# Altium project Radios_Comunitarias.PrjPcb
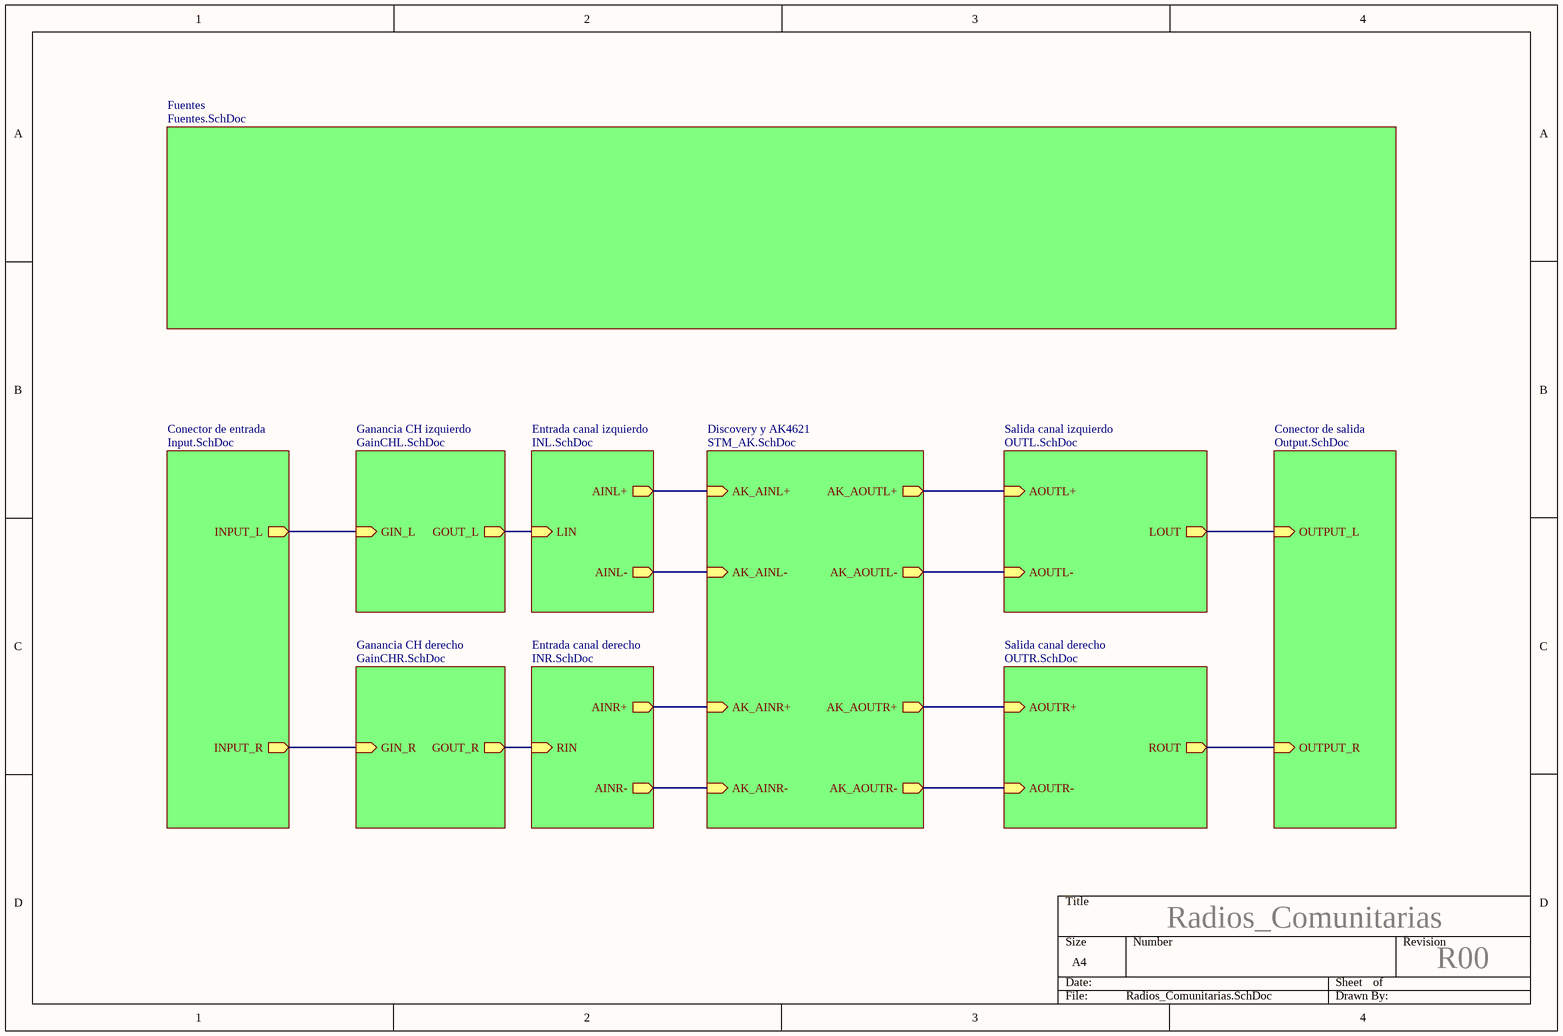
[diagram p0: Radios_Comunitarias.SchDoc]
11 sheets, 217 parts. Net scope: hierarchical (ports join the sheet entries above them; power ports are global).
Board file: Radios_Comunitarias.PcbDoc
Sheets:
  Radios_Comunitarias.SchDoc
    Entrada canal izquierdo = INL.SchDoc
    Entrada canal derecho = INR.SchDoc
    Discovery y AK4621 = STM_AK.SchDoc
    Salida canal izquierdo = OUTL.SchDoc
    Salida canal derecho = OUTR.SchDoc
    Conector de entrada = Input.SchDoc
    Conector de salida = Output.SchDoc
    Fuentes = Fuentes.SchDoc
    Ganancia CH izquierdo = GainCHL.SchDoc
    Ganancia CH derecho = GainCHR.SchDoc

## Sheet Radios_Comunitarias.SchDoc
size A4

### Sub-sheets
Conector de entrada = Input.SchDoc: INPUT_L (out), INPUT_R (out)
Conector de salida = Output.SchDoc: OUTPUT_R (in), OUTPUT_L (in)
Discovery y AK4621 = STM_AK.SchDoc: AK_AINL+ (in), AK_AINL- (in), AK_AINR- (in), AK_AINR+ (in), AK_AOUTL+ (out), AK_AOUTL- (out), AK_AOUTR+ (out), AK_AOUTR- (out)
Entrada canal derecho = INR.SchDoc: RIN (in), AINR+ (out), AINR- (out)
Entrada canal izquierdo = INL.SchDoc: LIN (in), AINL+ (out), AINL- (out)
Fuentes = Fuentes.SchDoc: no entries
Ganancia CH derecho = GainCHR.SchDoc: GOUT_R (out), GIN_R (in)
Ganancia CH izquierdo = GainCHL.SchDoc: GIN_L (in), GOUT_L (out)
Salida canal derecho = OUTR.SchDoc: AOUTR- (in), AOUTR+ (in), ROUT (out)
Salida canal izquierdo = OUTL.SchDoc: AOUTL+ (in), AOUTL- (in), LOUT (out)

### Nets
AINL_N: sheet Entrada canal izquierdo/AINL-, sheet Discovery y AK4621/AK_AINL-
AINL_P: sheet Entrada canal izquierdo/AINL+, sheet Discovery y AK4621/AK_AINL+
AINR_N: sheet Entrada canal derecho/AINR-, sheet Discovery y AK4621/AK_AINR-
AINR_P: sheet Entrada canal derecho/AINR+, sheet Discovery y AK4621/AK_AINR+
NetC25_2: sheet Entrada canal izquierdo/LIN, sheet Ganancia CH izquierdo/GOUT_L
NetC36_2: sheet Entrada canal derecho/RIN, sheet Ganancia CH derecho/GOUT_R
NetCN2_2: sheet Conector de entrada/INPUT_L, sheet Ganancia CH izquierdo/GIN_L
NetCN3_2: sheet Conector de entrada/INPUT_R, sheet Ganancia CH derecho/GIN_R
NetJP10_1: sheet Discovery y AK4621/AK_AOUTL-, sheet Salida canal izquierdo/AOUTL-
NetJP11_1: sheet Discovery y AK4621/AK_AOUTL+, sheet Salida canal izquierdo/AOUTL+
NetJP12_1: sheet Discovery y AK4621/AK_AOUTR-, sheet Salida canal derecho/AOUTR-
NetJP13_1: sheet Discovery y AK4621/AK_AOUTR+, sheet Salida canal derecho/AOUTR+
NetP3_1: sheet Salida canal izquierdo/LOUT, sheet Conector de salida/OUTPUT_L
NetP4_1: sheet Salida canal derecho/ROUT, sheet Conector de salida/OUTPUT_R

### Notes on the sheet
- Radios_Comunitarias
- R00

## Sheet INL.SchDoc
size A4
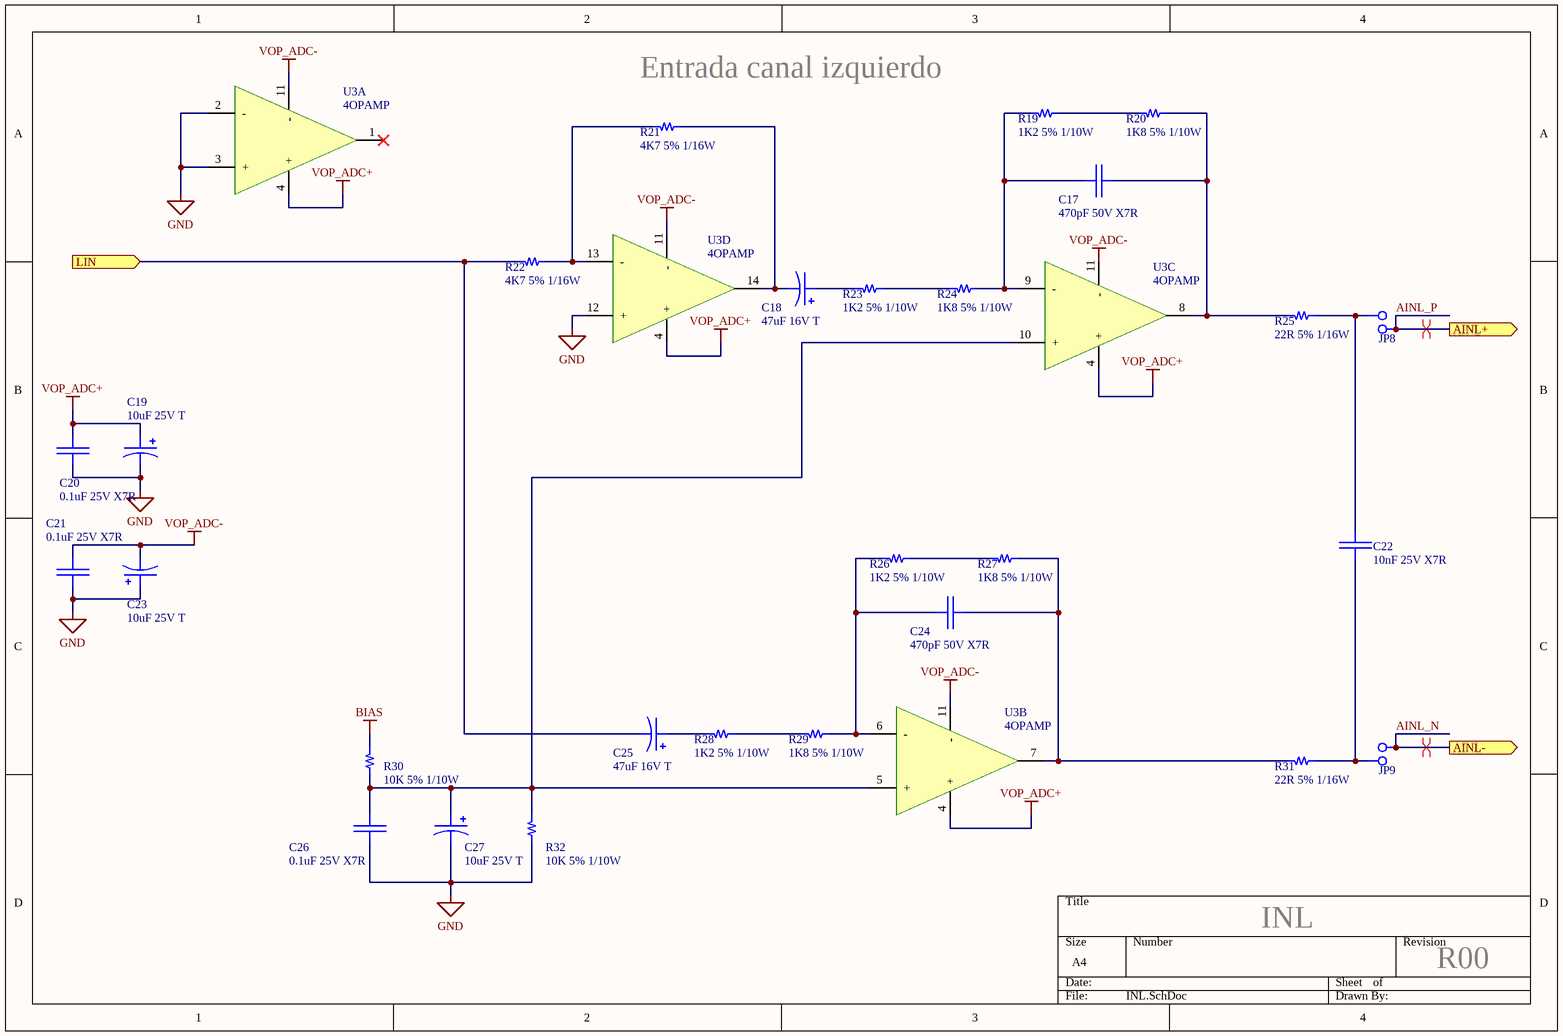
[diagram p1: INL.SchDoc]

### Parts
C17  470pF 50V X7R  [C_0805]
C18  47uF 16V T  [TANT]
C19  10uF 25V T  [TANT]
C20  0.1uF 25V X7R  [C_0805]
C21  0.1uF 25V X7R  [C_0805]
C22  10nF 25V X7R  [C_0805]
C23  10uF 25V T  [TANT]
C24  470pF 50V X7R  [C_0805]
C25  47uF 16V T  [TANT]
C26  0.1uF 25V X7R  [C_0805]
C27  10uF 25V T  [TANT]
JP8  Jumper 2x1  [Conn_2_1]  (value not drawn)
JP9  Jumper 2x1  [Conn_2_1]  (value not drawn)
R19  1K2 5% 1/10W  [R_0805]
R20  1K8 5% 1/10W  [R_0805]
R21  4K7 5% 1/16W  [R_0805]
R22  4K7 5% 1/16W  [R_0805]
R23  1K2 5% 1/10W  [R_0805]
R24  1K8 5% 1/10W  [R_0805]
R25  22R 5% 1/16W  [R_0805]
R26  1K2 5% 1/10W  [R_0805]
R27  1K8 5% 1/10W  [R_0805]
R28  1K2 5% 1/10W  [R_0805]
R29  1K8 5% 1/10W  [R_0805]
R30  10K 5% 1/10W  [R_0805]
R31  22R 5% 1/16W  [R_0805]
R32  10K 5% 1/10W  [R_0805]
U3  4OPAMP  [SOIC14]  (parts A,B,C,D of 4)

### Ports
AINL+ (out), AINL- (out), LIN (in)

### Nets
BIAS: R30.2  [project net AVDD]
GND: C19.2 C20.2 C21.2 C23.1 C26.2 C27.2 R32.1 U3.2(-) U3.3(+) U3.12(+)  [project net GROUND]
VOP_ADC+: C19.1 C20.1 U3.4(+)
VOP_ADC-: C21.1 C23.2 U3.11(-)
AINL_N: JP9.1 ; port AINL-
AINL_P: JP8.2 ; port AINL+
NetC17_1: C17.1 R19.2 R24.1 U3.9(-)
NetC17_2: C17.2 R20.1 R25.2 U3.8(OUT)
NetC18_1: C18.1 R23.2
NetC18_2: C18.2 R21.1 U3.14(OUT)
NetC22_1: C22.1 JP9.2 R31.1
NetC22_2: C22.2 JP8.1 R25.1
NetC24_1: C24.1 R26.2 R29.1 U3.6(-)
NetC24_2: C24.2 R27.1 R31.2 U3.7(OUT)
NetC25_1: C25.1 R28.2
NetC25_2: C25.2 R22.2 ; port LIN
NetC26_1: C26.1 C27.1 R30.1 R32.2 U3.5(+) U3.10(+)
NetR19_1: R19.1 R20.2
NetR21_2: R21.2 R22.1 U3.13(-)
NetR23_1: R23.1 R24.2
NetR26_1: R26.1 R27.2
NetR28_1: R28.1 R29.2

Not connected (* = marked no-connect by the designer): U3 1(OUT)*

### Layout directives
differential pair: AINL_N, AINL_P

### Notes on the sheet
- Entrada canal izquierdo
- INL
- R00

### Library data of the parts
C17 C24 = Capacitor: Capacitor de placas paralelas; Encapsulado: 0805; Cod. Proveedor: -; Proveedor: -
C18 C19 C23 C25 C27 = CapaPol: Capacitor polarizado; Encapsulado: TH; Cod. Proveedor: -; Proveedor: -
C20 C21 = Capacitor: Capacitor de placas paralelas; Cod. Proveedor: CA3289100; Encapsulado: 0603; Proveedor: Elemon
C22 = Capacitor: Capacitor de placas paralelas; Cod. Proveedor: CA3289050; Encapsulado: 0603; Proveedor: Elemon
C26 = Capacitor: Capacitor de placas paralelas
R19 R23 R26 R28 R30 R32 = Resistor: Resistencia; Encapsulado: 0805; Cod. Proveedor: -; Proveedor: -
R20 R24 R27 R29 = Resistor: Resistencia; Cod. Proveedor: RS3896200; Encapsulado: 0805; Proveedor: Elemon
R21 = Resistor: Resistencia; Cod. Proveedor: RS3896225; Proveedor: Elemon; Encapsulado: 0805
R22 = Resistor: Resistencia; Proveedor: Elemon; Cod. Proveedor: RS3896225; Encapsulado: 0805
R25 R31 = Resistor: Resistencia; Encapsulado: 0603; Cod. Proveedor: -; Proveedor: -
U3 = 4OPAMP: Integrado con 4 operacionales

## Sheet INR.SchDoc
size A4
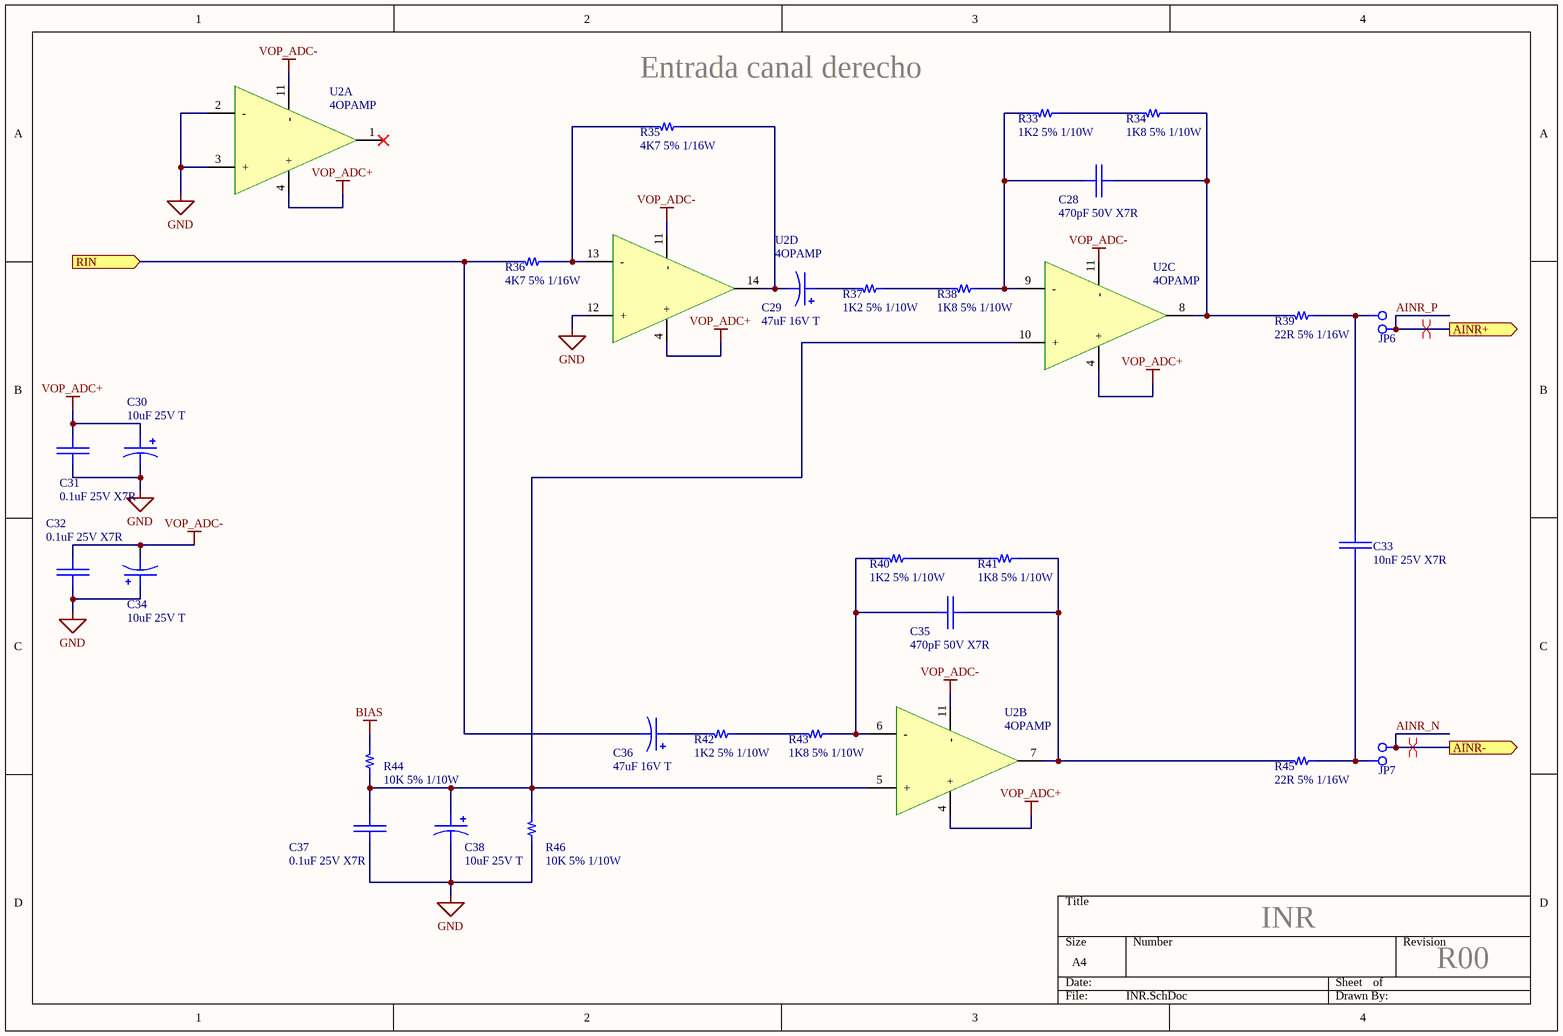
[diagram p2: INR.SchDoc]

### Parts
C28  470pF 50V X7R  [C_0805]
C29  47uF 16V T  [TANT]
C30  10uF 25V T  [TANT]
C31  0.1uF 25V X7R  [C_0805]
C32  0.1uF 25V X7R  [C_0805]
C33  10nF 25V X7R  [C_0805]
C34  10uF 25V T  [TANT]
C35  470pF 50V X7R  [C_0805]
C36  47uF 16V T  [TANT]
C37  0.1uF 25V X7R  [C_0805]
C38  10uF 25V T  [TANT]
JP6  Jumper 2x1  [Conn_2_1]  (value not drawn)
JP7  Jumper 2x1  [Conn_2_1]  (value not drawn)
R33  1K2 5% 1/10W  [R_0805]
R34  1K8 5% 1/10W  [R_0805]
R35  4K7 5% 1/16W  [R_0805]
R36  4K7 5% 1/16W  [R_0805]
R37  1K2 5% 1/10W  [R_0805]
R38  1K8 5% 1/10W  [R_0805]
R39  22R 5% 1/16W  [R_0805]
R40  1K2 5% 1/10W  [R_0805]
R41  1K8 5% 1/10W  [R_0805]
R42  1K2 5% 1/10W  [R_0805]
R43  1K8 5% 1/10W  [R_0805]
R44  10K 5% 1/10W  [R_0805]
R45  22R 5% 1/16W  [R_0805]
R46  10K 5% 1/10W  [R_0805]
U2  4OPAMP  [SOIC14]  (parts A,B,C,D of 4)

### Ports
AINR+ (out), AINR- (out), RIN (in)

### Nets
BIAS: R44.2  [project net AVDD]
GND: C30.2 C31.2 C32.2 C34.1 C37.2 C38.2 R46.1 U2.2(-) U2.3(+) U2.12(+)  [project net GROUND]
VOP_ADC+: C30.1 C31.1 U2.4(+)
VOP_ADC-: C32.1 C34.2 U2.11(-)
AINR_N: JP7.1 ; port AINR-
AINR_P: JP6.2 ; port AINR+
NetC28_1: C28.1 R33.2 R38.1 U2.9(-)
NetC28_2: C28.2 R34.1 R39.2 U2.8(OUT)
NetC29_1: C29.1 R37.2
NetC29_2: C29.2 R35.1 U2.14(OUT)
NetC33_1: C33.1 JP7.2 R45.1
NetC33_2: C33.2 JP6.1 R39.1
NetC35_1: C35.1 R40.2 R43.1 U2.6(-)
NetC35_2: C35.2 R41.1 R45.2 U2.7(OUT)
NetC36_1: C36.1 R42.2
NetC36_2: C36.2 R36.2 ; port RIN
NetC37_1: C37.1 C38.1 R44.1 R46.2 U2.5(+) U2.10(+)
NetR33_1: R33.1 R34.2
NetR35_2: R35.2 R36.1 U2.13(-)
NetR37_1: R37.1 R38.2
NetR40_1: R40.1 R41.2
NetR42_1: R42.1 R43.2

Not connected (* = marked no-connect by the designer): U2 1(OUT)*

### Layout directives
differential pair: AINR_N, AINR_P

### Notes on the sheet
- (near R35) Entrada canal derecho
- INR
- R00

### Library data of the parts
C28 C35 = Capacitor: as C17 on sheet INL; Cod. Proveedor: -; Proveedor: -
C29 C30 C34 C36 C38 = CapaPol: Capacitor polarizado; Encapsulado: TH; Cod. Proveedor: -; Proveedor: -
C31 C32 = Capacitor: as C20 on sheet INL
C33 C37 = Capacitor: Capacitor de placas paralelas
R33 R37 R40 R42 R44 R46 = Resistor: Resistencia; Encapsulado: 0805; Cod. Proveedor: -; Proveedor: -
R34 R38 R41 R43 = Resistor: as R20 on sheet INL
R35 R36 = Resistor: as R21 on sheet INL
R39 R45 = Resistor: Resistencia; Encapsulado: 0603; Cod. Proveedor: -; Proveedor: -
U2 = 4OPAMP: Integrado con 4 operacionales

## Sheet STM_AK.SchDoc
size A4
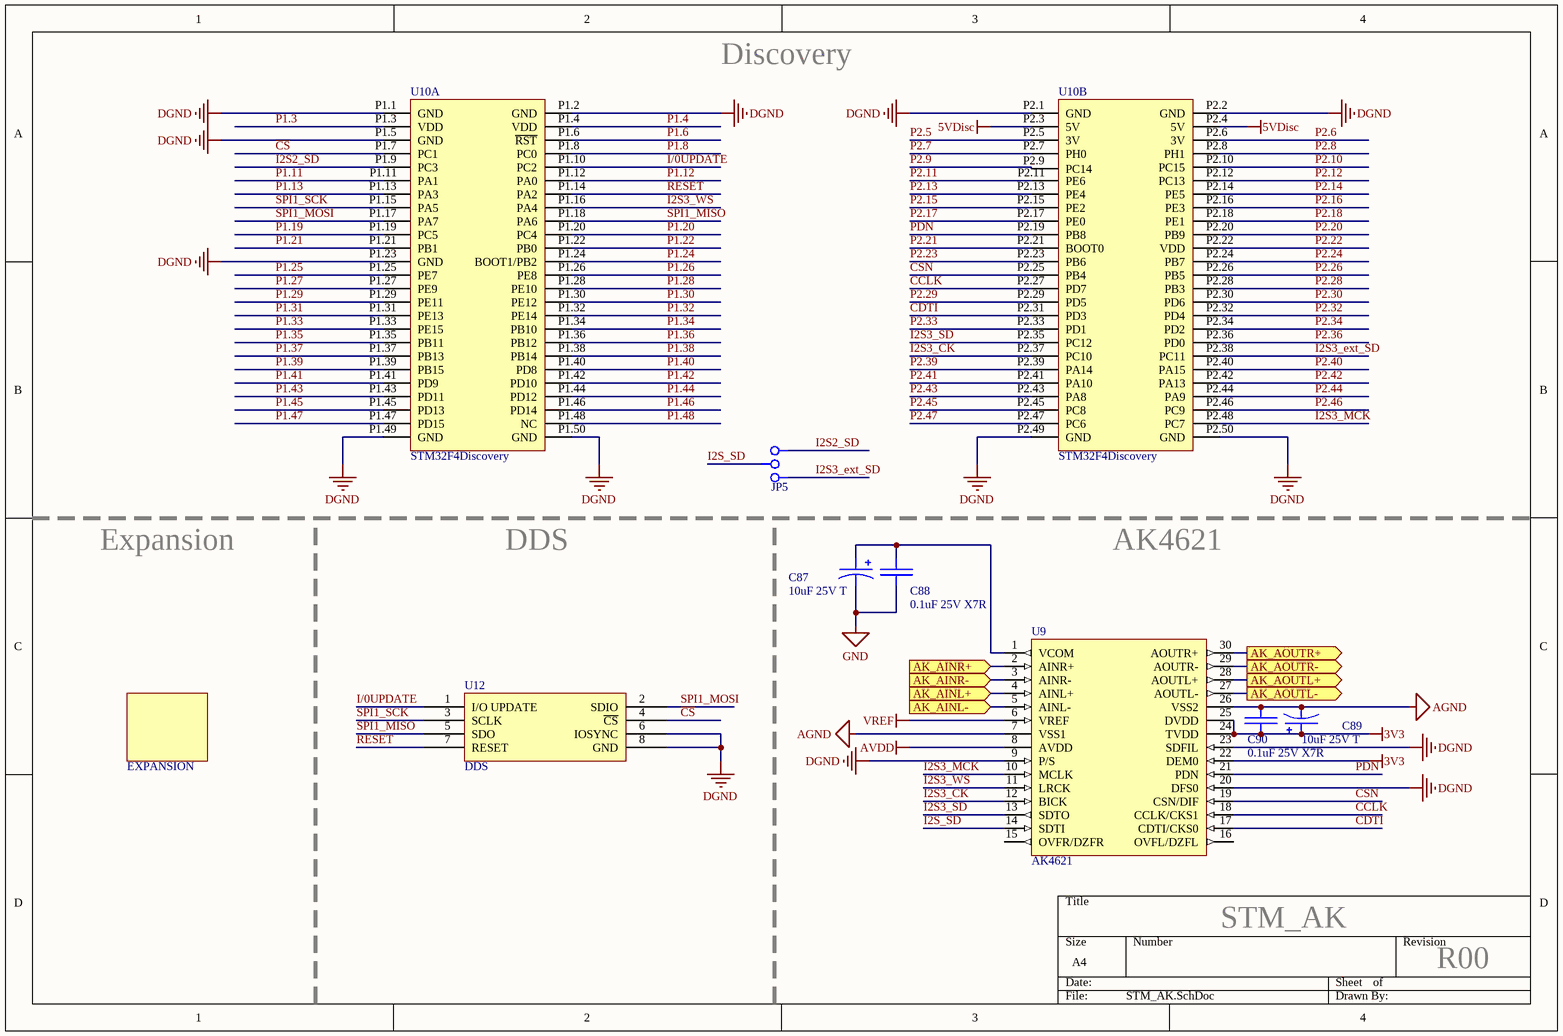
[diagram p3: STM_AK.SchDoc]

### Parts
C87  10uF 25V T  [TANT]
C88  0.1uF 25V X7R  [C_0805]
C89  10uF 25V T  [TANT]
C90  0.1uF 25V X7R  [C_0805]
JP5  Jumper 3x1  [Conn_3_1]  (value not drawn)
U9  AK4621  [AK4621]
U10  STM32F4Discovery  [STM32F4DISCOVERY]  (parts A,B of 2)
U12  DDS  [Conn_2x4]
  EXPANSION  [EXPANSION]

### Ports
AK_AINL+ (in), AK_AINL- (in), AK_AINR+ (in), AK_AINR- (in), AK_AOUTL+ (out), AK_AOUTL- (out), AK_AOUTR+ (out), AK_AOUTR- (out)

### Nets
3V3: C89.1 C90.1 U9.22(DEM0) U9.24(TVDD) U9.25(DVDD)
5VDisc: U10.P2.3(5V) U10.P2.4(5V)
AGND: C89.2 C90.2 U9.7(VSS1) U9.26(VSS2)
AVDD: U9.6(VREF) U9.8(AVDD)  [also labelled VREF]
DGND: U9.9(P/S) U9.20(DFS0) U9.23(SDFIL) U10.P1.1(GND) U10.P1.2(GND) U10.P1.5(GND) U10.P1.23(GND) U10.P1.49(GND) U10.P1.50(GND) U10.P2.1(GND) U10.P2.2(GND) U10.P2.49(GND) U10.P2.50(GND) U12.6(IOSYNC) U12.8(GND)
GND: C87.2 C88.2  [project net GROUND]
AINL_N: U9.5(AINL-) ; port AK_AINL-
AINL_P: U9.4(AINL+) ; port AK_AINL+
AINR_N: U9.3(AINR-) ; port AK_AINR-
AINR_P: U9.2(AINR+) ; port AK_AINR+
~{CS}: U10.P1.7(PC1) U12.4(~{CS})
CCLK: U9.18(CCLK/CKS1) U10.P2.27(PD7)
CDTI: U9.17(CDTI/CKS0) U10.P2.31(PD3)
CSN: U9.19(CSN/DIF) U10.P2.25(PB4)
I2S2_SD: JP5.1 U10.P1.9(PC3)
I2S3_CK: U9.12(BICK) U10.P2.37(PC10)
I2S3_ext_SD: JP5.3 U10.P2.38(PC11)
I2S3_MCK: U9.10(MCLK) U10.P2.48(PC7)
I2S3_SD: U9.13(SDTO) U10.P2.35(PC12)
I2S3_WS: U9.11(LRCK) U10.P1.16(PA4)
I2S_SD: JP5.2 U9.14(SDTI)
I/0UPDATE: U10.P1.10(PC2) U12.1(I/O_UPDATE)
P1.3: U10.P1.3(VDD)
P1.4: U10.P1.4(VDD)
P1.6: U10.P1.6(~{RST})
P1.8: U10.P1.8(PC0)
P1.11: U10.P1.11(PA1)
P1.12: U10.P1.12(PA0)
P1.13: U10.P1.13(PA3)
P1.19: U10.P1.19(PC5)
P1.20: U10.P1.20(PC4)
P1.21: U10.P1.21(PB1)
P1.22: U10.P1.22(PB0)
P1.24: U10.P1.24(BOOT1/PB2)
P1.25: U10.P1.25(PE7)
P1.26: U10.P1.26(PE8)
P1.27: U10.P1.27(PE9)
P1.28: U10.P1.28(PE10)
P1.29: U10.P1.29(PE11)
P1.30: U10.P1.30(PE12)
P1.31: U10.P1.31(PE13)
P1.32: U10.P1.32(PE14)
P1.33: U10.P1.33(PE15)
P1.34: U10.P1.34(PB10)
P1.35: U10.P1.35(PB11)
P1.36: U10.P1.36(PB12)
P1.37: U10.P1.37(PB13)
P1.38: U10.P1.38(PB14)
P1.39: U10.P1.39(PB15)
P1.40: U10.P1.40(PD8)
P1.41: U10.P1.41(PD9)
P1.42: U10.P1.42(PD10)
P1.43: U10.P1.43(PD11)
P1.44: U10.P1.44(PD12)
P1.45: U10.P1.45(PD13)
P1.46: U10.P1.46(PD14)
P1.47: U10.P1.47(PD15)
P1.48: U10.P1.48(NC)
P2.5: U10.P2.5(3V)
P2.6: U10.P2.6(3V)
P2.7: U10.P2.7(PH0)
P2.8: U10.P2.8(PH1)
P2.9: U10.P2.9(PC14)
P2.10: U10.P2.10(PC15)
P2.11: U10.P2.11(PE6)
P2.12: U10.P2.12(PC13)
P2.13: U10.P2.13(PE4)
P2.14: U10.P2.14(PE5)
P2.15: U10.P2.15(PE2)
P2.16: U10.P2.16(PE3)
P2.17: U10.P2.17(PE0)
P2.18: U10.P2.18(PE1)
P2.20: U10.P2.20(PB9)
P2.21: U10.P2.21(BOOT0)
P2.22: U10.P2.22(VDD)
P2.23: U10.P2.23(PB6)
P2.24: U10.P2.24(PB7)
P2.26: U10.P2.26(PB5)
P2.28: U10.P2.28(PB3)
P2.29: U10.P2.29(PD5)
P2.30: U10.P2.30(PD6)
P2.32: U10.P2.32(PD4)
P2.33: U10.P2.33(PD1)
P2.34: U10.P2.34(PD2)
P2.36: U10.P2.36(PD0)
P2.39: U10.P2.39(PA14)
P2.40: U10.P2.40(PA15)
P2.41: U10.P2.41(PA10)
P2.42: U10.P2.42(PA13)
P2.43: U10.P2.43(PA8)
P2.44: U10.P2.44(PA9)
P2.45: U10.P2.45(PC8)
P2.46: U10.P2.46(PC9)
P2.47: U10.P2.47(PC6)
PDN: U9.21(PDN) U10.P2.19(PB8)
RESET: U10.P1.14(PA2) U12.7(RESET)
SPI1_MISO: U10.P1.18(PA6) U12.5(SDO)
SPI1_MOSI: U10.P1.17(PA7) U12.2(SDIO)
SPI1_SCK: U10.P1.15(PA5) U12.3(SCLK)
NetC87_1: C87.1 C88.1 U9.1(VCOM)
NetJP10_1: U9.27(AOUTL-) ; port AK_AOUTL-
NetJP11_1: U9.28(AOUTL+) ; port AK_AOUTL+
NetJP12_1: U9.29(AOUTR-) ; port AK_AOUTR-
NetJP13_1: U9.30(AOUTR+) ; port AK_AOUTR+

Not connected (* = marked no-connect by the designer): U9 15(OVFR/DZFR) 16(OVFL/DZFL)

### Notes on the sheet
- Discovery
- Expansion
- DDS
- AK4621
- STM_AK
- R00

### Library data of the parts
C87 C89 = CapaPol: Capacitor polarizado; Encapsulado: TH; Cod. Proveedor: -; Proveedor: -
C88 C90 = Capacitor: as C20 on sheet INL
JP5 = Jumper 3x1: Cod. Proveedor: CO4921360; Proveedor: Elemon
U9 = AK4621: CODEC 24 bits 192kHz; Cod. Proveedor: Ya esta; Encapsulado: SMD; Proveedor: Ya esta
U10 = STM32F4Discovery: Cod. Proveedor: MC6350305; Proveedor: Elemon
U12 = DDS_Pablo

## Sheet OUTL.SchDoc
size A4
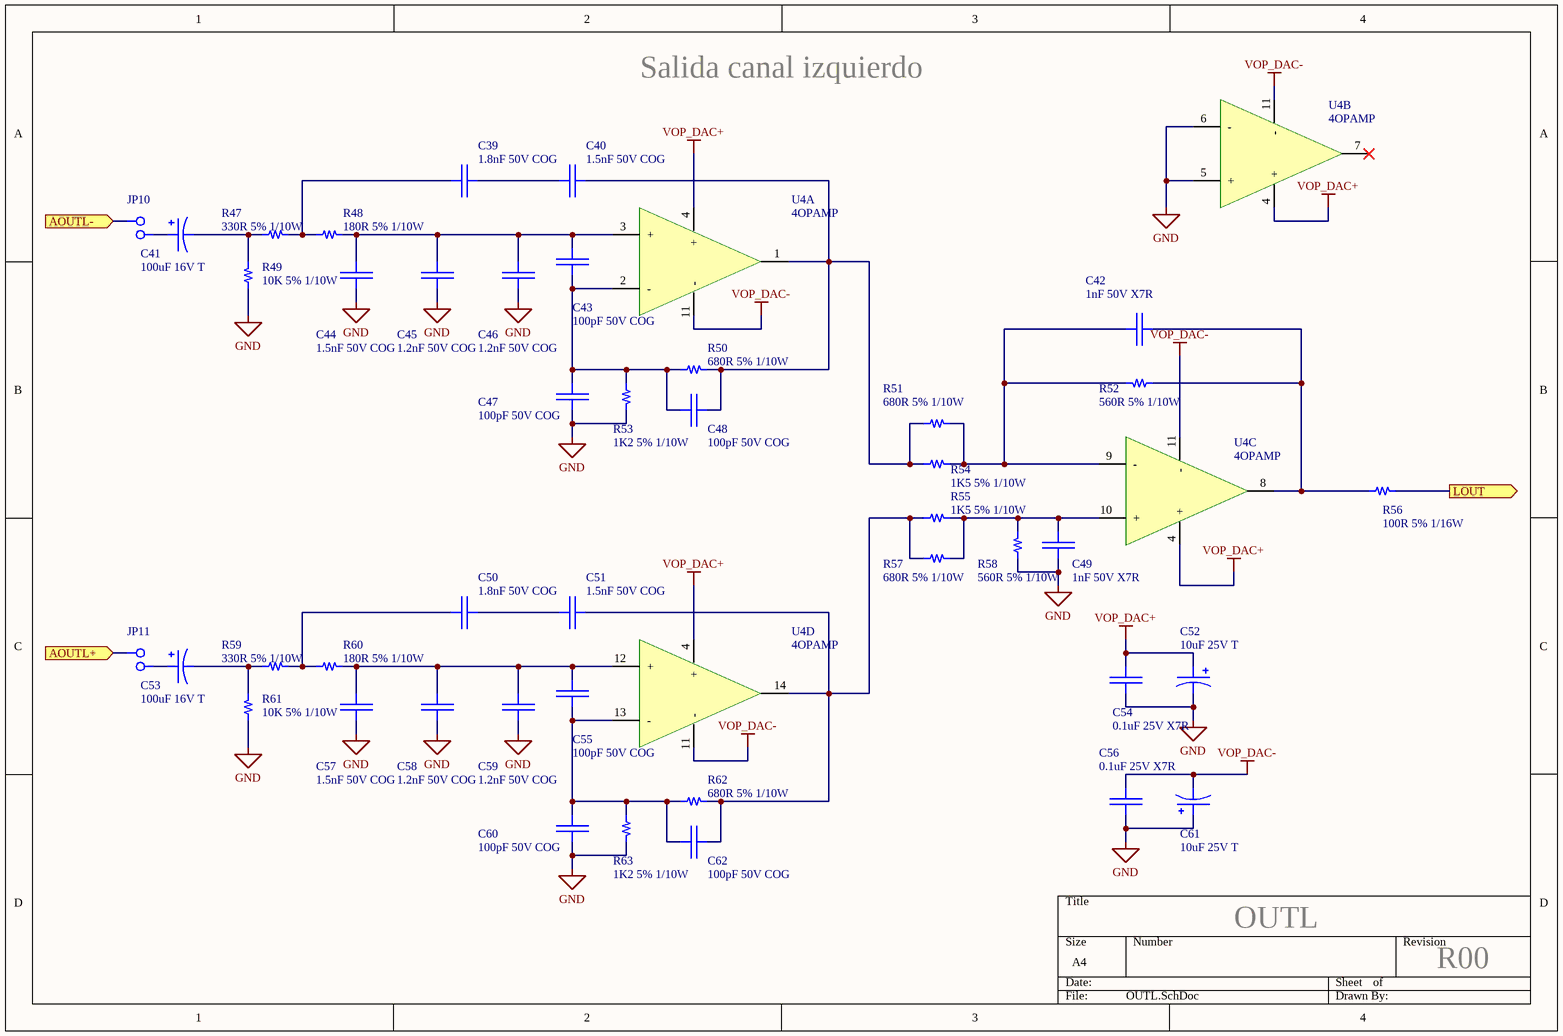
[diagram p4: OUTL.SchDoc]

### Parts
C39  1.8nF 50V COG  [C_0805]
C40  1.5nF 50V COG  [C_0805]
C41  100uF 16V T  [TANT]
C42  1nF 50V X7R  [C_0805]
C43  100pF 50V COG  [C_0805]
C44  1.5nF 50V COG  [C_0805]
C45  1.2nF 50V COG  [C_0805]
C46  1.2nF 50V COG  [C_0805]
C47  100pF 50V COG  [C_0805]
C48  100pF 50V COG  [C_0805]
C49  1nF 50V X7R  [C_0805]
C50  1.8nF 50V COG  [C_0805]
C51  1.5nF 50V COG  [C_0805]
C52  10uF 25V T  [TANT]
C53  100uF 16V T  [TANT]
C54  0.1uF 25V X7R  [C_0805]
C55  100pF 50V COG  [C_0805]
C56  0.1uF 25V X7R  [C_0805]
C57  1.5nF 50V COG  [C_0805]
C58  1.2nF 50V COG  [C_0805]
C59  1.2nF 50V COG  [C_0805]
C60  100pF 50V COG  [C_0805]
C61  10uF 25V T  [TANT]
C62  100pF 50V COG  [C_0805]
JP10  Jumper 2x1  [Conn_2_1]  (value not drawn)
JP11  Jumper 2x1  [Conn_2_1]  (value not drawn)
R47  330R 5% 1/10W  [R_0805]
R48  180R 5% 1/10W  [R_0805]
R49  10K 5% 1/10W  [R_0805]
R50  680R 5% 1/10W  [R_0805]
R51  680R 5% 1/10W  [R_0805]
R52  560R 5% 1/10W  [R_0805]
R53  1K2 5% 1/10W  [R_0805]
R54  1K5 5% 1/10W  [R_0805]
R55  1K5 5% 1/10W  [R_0805]
R56  100R 5% 1/16W  [R_0805]
R57  680R 5% 1/10W  [R_0805]
R58  560R 5% 1/10W  [R_0805]
R59  330R 5% 1/10W  [R_0805]
R60  180R 5% 1/10W  [R_0805]
R61  10K 5% 1/10W  [R_0805]
R62  680R 5% 1/10W  [R_0805]
R63  1K2 5% 1/10W  [R_0805]
U4  4OPAMP  [SOIC14]  (parts A,B,C,D of 4)

### Ports
AOUTL+ (in), AOUTL- (in), LOUT (out)

### Nets
GND: C44.1 C45.1 C46.1 C47.2 C49.2 C52.2 C54.2 C56.2 C57.1 C58.1 C59.1 C60.2 C61.1 R49.1 R53.2 R58.1 R61.1 R63.2 U4.5(+) U4.6(-)  [project net GROUND]
VOP_DAC+: C52.1 C54.1 U4.4(+)
VOP_DAC-: C56.1 C61.2 U4.11(-)
NetC39_1: C39.1 C40.2
NetC39_2: C39.2 R47.2 R48.1
NetC40_1: C40.1 C48.2 R50.2 R51.1 R54.1 U4.1(OUT)
NetC41_1: C41.1 JP10.2
NetC41_2: C41.2 R47.1 R49.2
NetC42_1: C42.1 R51.2 R52.2 R54.2 U4.9(-)
NetC42_2: C42.2 R52.1 R56.1 U4.8(OUT)
NetC43_1: C43.1 C44.2 C45.2 C46.2 R48.2 U4.3(+)
NetC43_2: C43.2 C47.1 C48.1 R50.1 R53.1 U4.2(-)
NetC49_1: C49.1 R55.2 R57.2 R58.2 U4.10(+)
NetC50_1: C50.1 C51.2
NetC50_2: C50.2 R59.2 R60.1
NetC51_1: C51.1 C62.2 R55.1 R57.1 R62.2 U4.14(OUT)
NetC53_1: C53.1 JP11.2
NetC53_2: C53.2 R59.1 R61.2
NetC55_1: C55.1 C57.2 C58.2 C59.2 R60.2 U4.12(+)
NetC55_2: C55.2 C60.1 C62.1 R62.1 R63.1 U4.13(-)
NetJP10_1: JP10.1 ; port AOUTL-
NetJP11_1: JP11.1 ; port AOUTL+
NetP3_1: R56.2 ; port LOUT

Not connected (* = marked no-connect by the designer): U4 7(OUT)*

### Notes on the sheet
- Salida canal izquierdo
- OUTL
- R00

### Library data of the parts
C39 C40 C44-C46 C50 C51 C57-C59 = Capacitor: as C17 on sheet INL; Cod. Proveedor: -; Proveedor: -
C41 C52 C53 C61 = CapaPol: Capacitor polarizado; Encapsulado: TH; Cod. Proveedor: -; Proveedor: -
C42 C49 = Capacitor: Capacitor de placas paralelas; Cod. Proveedor: CA3289020; Encapsulado: 0603; Proveedor: Elemon
C43 C47 C48 C55 C60 C62 = Capacitor: Capacitor de placas paralelas; Cod. Proveedor: CA3288850; Encapsulado: 0603; Proveedor: Elemon
C54 C56 = Capacitor: as C20 on sheet INL
R47 R59 = Resistor: Resistencia; Cod. Proveedor: RS3896155; Encapsulado: 0805; Proveedor: Elemon
R48 R60 = Resistor: Resistencia; Cod. Proveedor: RS3896140; Encapsulado: 0805; Proveedor: Elemon
R49-R51 R53-R55 R57 R61-R63 = Resistor: Resistencia; Encapsulado: 0805; Cod. Proveedor: -; Proveedor: -
R52 = Resistor: Resistencia; Cod. Proveedor: RS3896170; Encapsulado: 0805; Proveedor: Elemon
R56 = Resistor: Resistencia; Cod. Proveedor: RS3866125; Encapsulado: 0603; Proveedor: Elemon
R58 = Resistor: Resistencia
U4 = 4OPAMP: Integrado con 4 operacionales

## Sheet OUTR.SchDoc
size A4
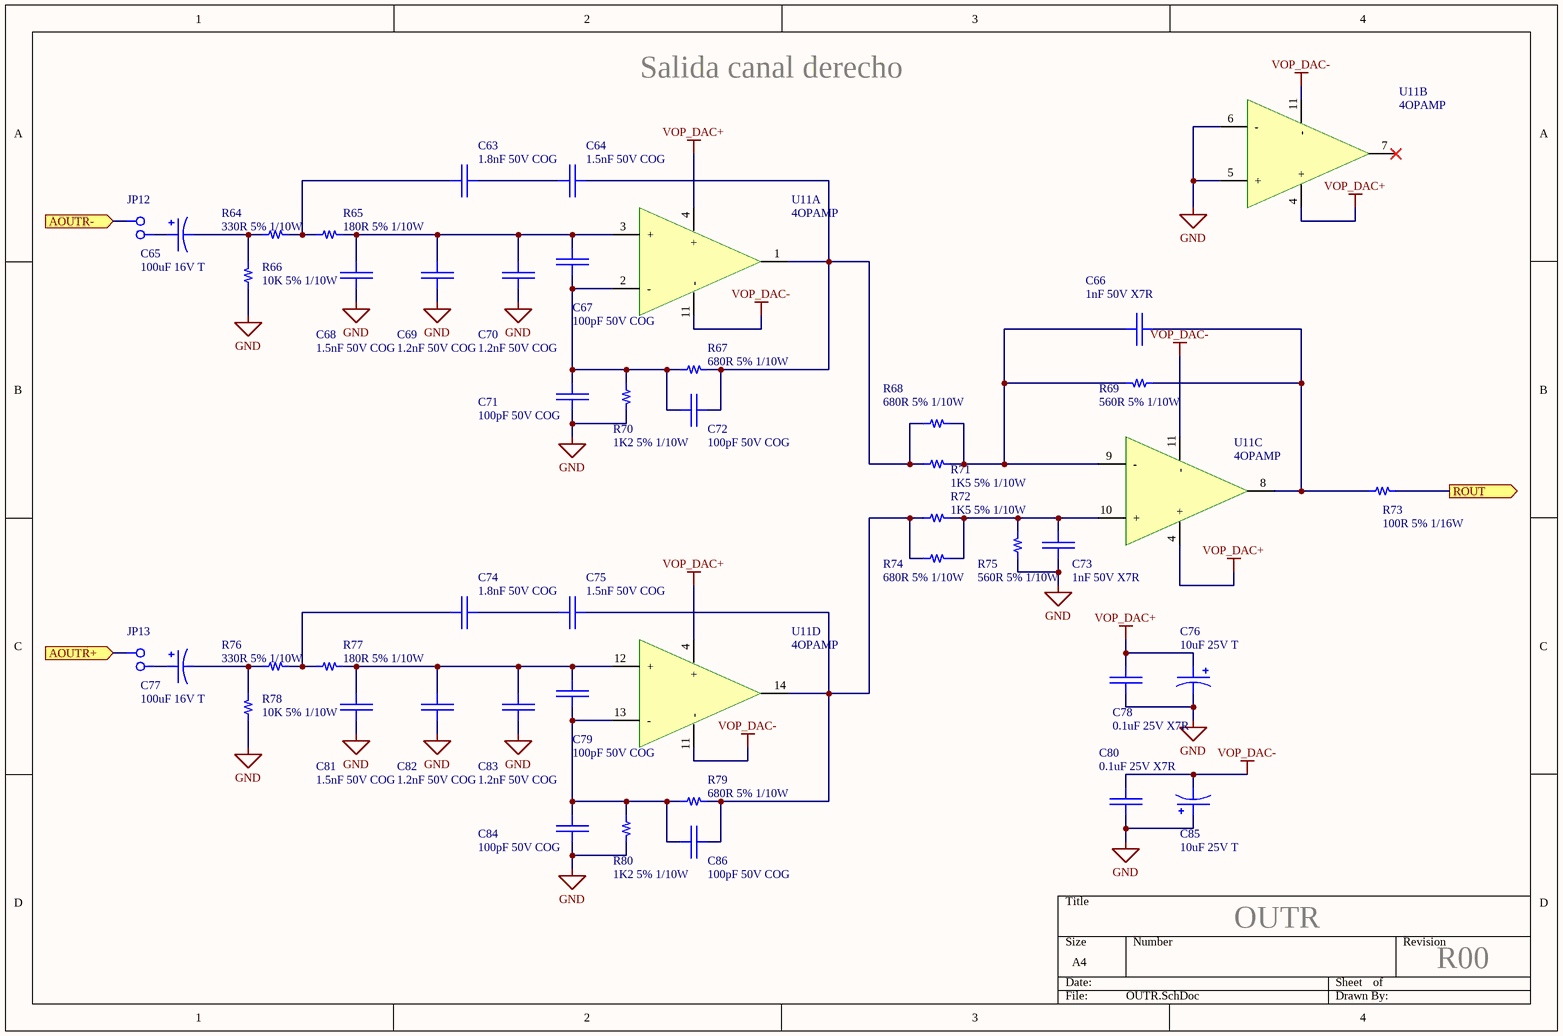
[diagram p5: OUTR.SchDoc]

### Parts
C63  1.8nF 50V COG  [C_0805]
C64  1.5nF 50V COG  [C_0805]
C65  100uF 16V T  [TANT]
C66  1nF 50V X7R  [C_0805]
C67  100pF 50V COG  [C_0805]
C68  1.5nF 50V COG  [C_0805]
C69  1.2nF 50V COG  [C_0805]
C70  1.2nF 50V COG  [C_0805]
C71  100pF 50V COG  [C_0805]
C72  100pF 50V COG  [C_0805]
C73  1nF 50V X7R  [C_0805]
C74  1.8nF 50V COG  [C_0805]
C75  1.5nF 50V COG  [C_0805]
C76  10uF 25V T  [TANT]
C77  100uF 16V T  [TANT]
C78  0.1uF 25V X7R  [C_0805]
C79  100pF 50V COG  [C_0805]
C80  0.1uF 25V X7R  [C_0805]
C81  1.5nF 50V COG  [C_0805]
C82  1.2nF 50V COG  [C_0805]
C83  1.2nF 50V COG  [C_0805]
C84  100pF 50V COG  [C_0805]
C85  10uF 25V T  [TANT]
C86  100pF 50V COG  [C_0805]
JP12  Jumper 2x1  [Conn_2_1]  (value not drawn)
JP13  Jumper 2x1  [Conn_2_1]  (value not drawn)
R64  330R 5% 1/10W  [R_0805]
R65  180R 5% 1/10W  [R_0805]
R66  10K 5% 1/10W  [R_0805]
R67  680R 5% 1/10W  [R_0805]
R68  680R 5% 1/10W  [R_0805]
R69  560R 5% 1/10W  [R_0805]
R70  1K2 5% 1/10W  [R_0805]
R71  1K5 5% 1/10W  [R_0805]
R72  1K5 5% 1/10W  [R_0805]
R73  100R 5% 1/16W  [R_0805]
R74  680R 5% 1/10W  [R_0805]
R75  560R 5% 1/10W  [R_0805]
R76  330R 5% 1/10W  [R_0805]
R77  180R 5% 1/10W  [R_0805]
R78  10K 5% 1/10W  [R_0805]
R79  680R 5% 1/10W  [R_0805]
R80  1K2 5% 1/10W  [R_0805]
U11  4OPAMP  [SOIC14]  (parts A,B,C,D of 4)

### Ports
AOUTR+ (in), AOUTR- (in), ROUT (out)

### Nets
GND: C68.1 C69.1 C70.1 C71.2 C73.2 C76.2 C78.2 C80.2 C81.1 C82.1 C83.1 C84.2 C85.1 R66.1 R70.2 R75.1 R78.1 R80.2 U11.5(+) U11.6(-)  [project net GROUND]
VOP_DAC+: C76.1 C78.1 U11.4(+)
VOP_DAC-: C80.1 C85.2 U11.11(-)
NetC63_1: C63.1 C64.2
NetC63_2: C63.2 R64.2 R65.1
NetC64_1: C64.1 C72.2 R67.2 R68.1 R71.1 U11.1(OUT)
NetC65_1: C65.1 JP12.2
NetC65_2: C65.2 R64.1 R66.2
NetC66_1: C66.1 R68.2 R69.2 R71.2 U11.9(-)
NetC66_2: C66.2 R69.1 R73.1 U11.8(OUT)
NetC67_1: C67.1 C68.2 C69.2 C70.2 R65.2 U11.3(+)
NetC67_2: C67.2 C71.1 C72.1 R67.1 R70.1 U11.2(-)
NetC73_1: C73.1 R72.2 R74.2 R75.2 U11.10(+)
NetC74_1: C74.1 C75.2
NetC74_2: C74.2 R76.2 R77.1
NetC75_1: C75.1 C86.2 R72.1 R74.1 R79.2 U11.14(OUT)
NetC77_1: C77.1 JP13.2
NetC77_2: C77.2 R76.1 R78.2
NetC79_1: C79.1 C81.2 C82.2 C83.2 R77.2 U11.12(+)
NetC79_2: C79.2 C84.1 C86.1 R79.1 R80.1 U11.13(-)
NetJP12_1: JP12.1 ; port AOUTR-
NetJP13_1: JP13.1 ; port AOUTR+
NetP4_1: R73.2 ; port ROUT

Not connected (* = marked no-connect by the designer): U11 7(OUT)*

### Notes on the sheet
- Salida canal derecho
- OUTR
- R00

### Library data of the parts
C63 C64 C68-C70 C74 C75 C81-C83 = Capacitor: as C17 on sheet INL; Cod. Proveedor: -; Proveedor: -
C65 C76 C77 C85 = CapaPol: Capacitor polarizado; Encapsulado: TH; Cod. Proveedor: -; Proveedor: -
C66 C73 = Capacitor: as C42 on sheet OUTL
C67 C71 C72 C79 C84 C86 = Capacitor: as C43 on sheet OUTL
C78 C80 = Capacitor: as C20 on sheet INL
R64 R76 = Resistor: as R47 on sheet OUTL
R65 R77 = Resistor: as R48 on sheet OUTL
R66-R68 R70-R72 R74 R78-R80 = Resistor: Resistencia; Encapsulado: 0805; Cod. Proveedor: -; Proveedor: -
R69 R75 = Resistor: as R52 on sheet OUTL
R73 = Resistor: as R56 on sheet OUTL
U11 = 4OPAMP: Integrado con 4 operacionales

## Sheet Input.SchDoc
size A4
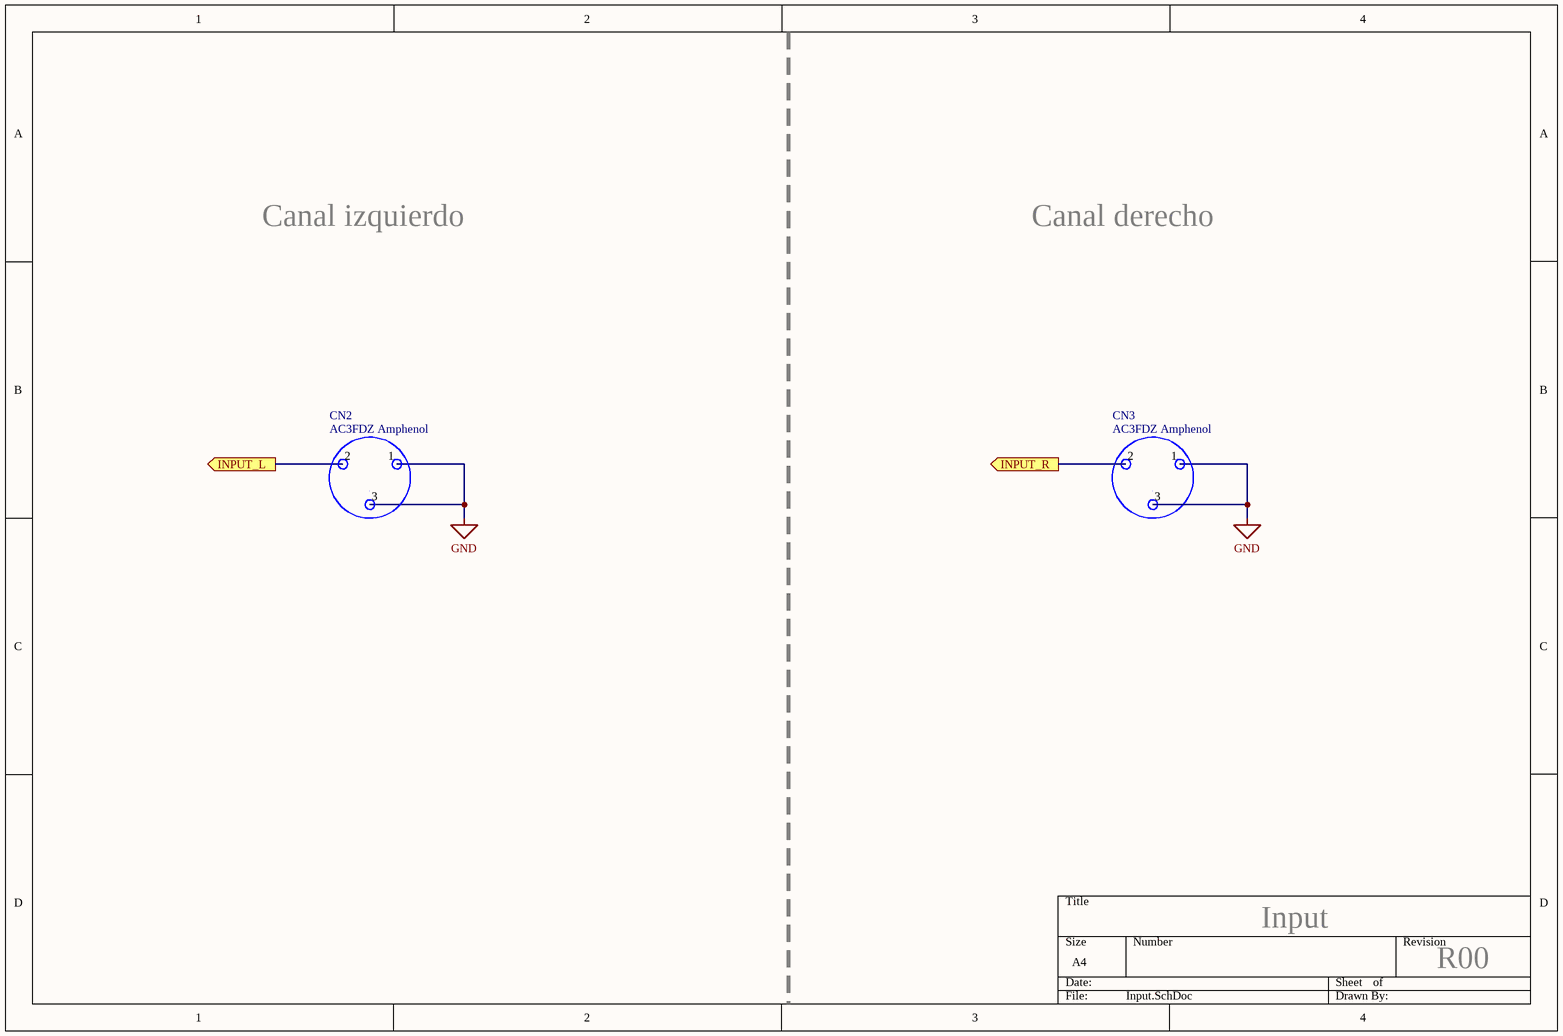
[diagram p6: Input.SchDoc]

### Parts
CN2  AC3FDZ Amphenol  [XLR_Ext]
CN3  AC3FDZ Amphenol  [XLR_Ext]

### Ports
INPUT_L (out), INPUT_R (out)

### Nets
GND: CN2.1(Chasis) CN2.3(Cold) CN3.1(Chasis) CN3.3(Cold)  [project net GROUND]
NetCN2_2: CN2.2(Hot) ; port INPUT_L
NetCN3_2: CN3.2(Hot) ; port INPUT_R

### Notes on the sheet
- Canal izquierdo
- Canal derecho
- Input
- R00

### Library data of the parts
CN2 CN3 = XLR_hembra: XLR connector (canon) hembra

## Sheet Output.SchDoc
size A4
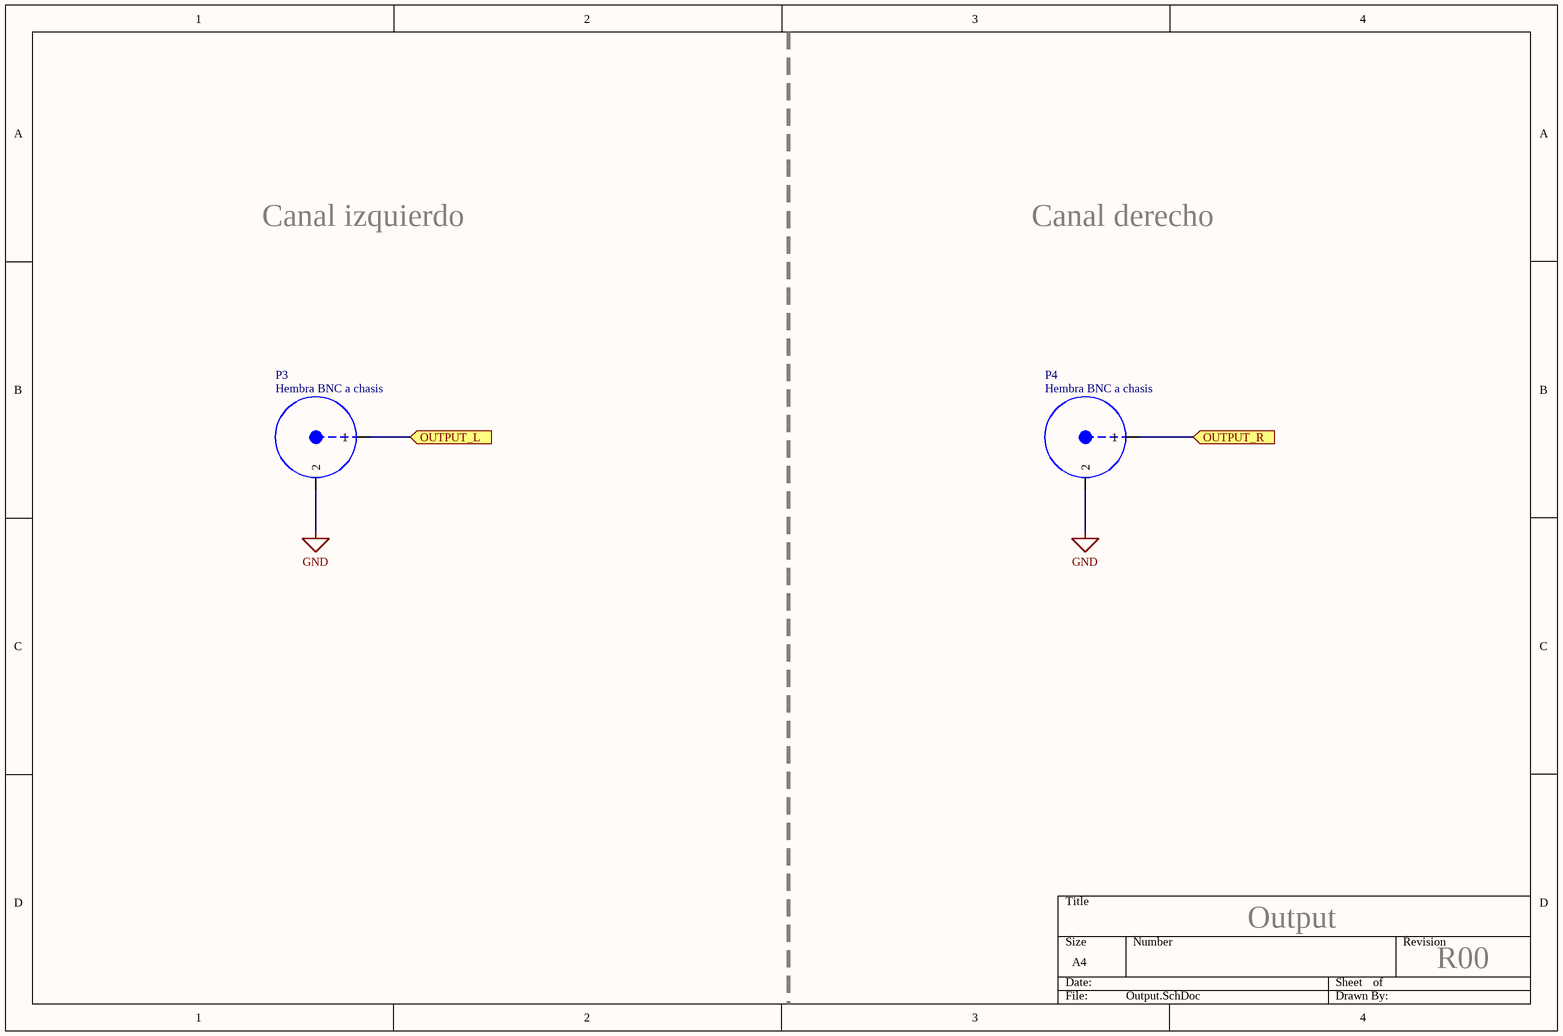
[diagram p7: Output.SchDoc]

### Parts
P3  Hembra BNC a chasis  [BNC_Ext]
P4  Hembra BNC a chasis  [BNC_Ext]

### Ports
OUTPUT_L (in), OUTPUT_R (in)

### Nets
GND: P3.2 P4.2  [project net GROUND]
NetP3_1: P3.1 ; port OUTPUT_L
NetP4_1: P4.1 ; port OUTPUT_R

### Notes on the sheet
- Canal izquierdo
- Canal derecho
- Output
- R00

### Library data of the parts
P3 P4 = BNC: BNC connector; Cod. Proveedor: Consultar; Proveedor: Elemon

## Sheet Fuentes.SchDoc
size A4
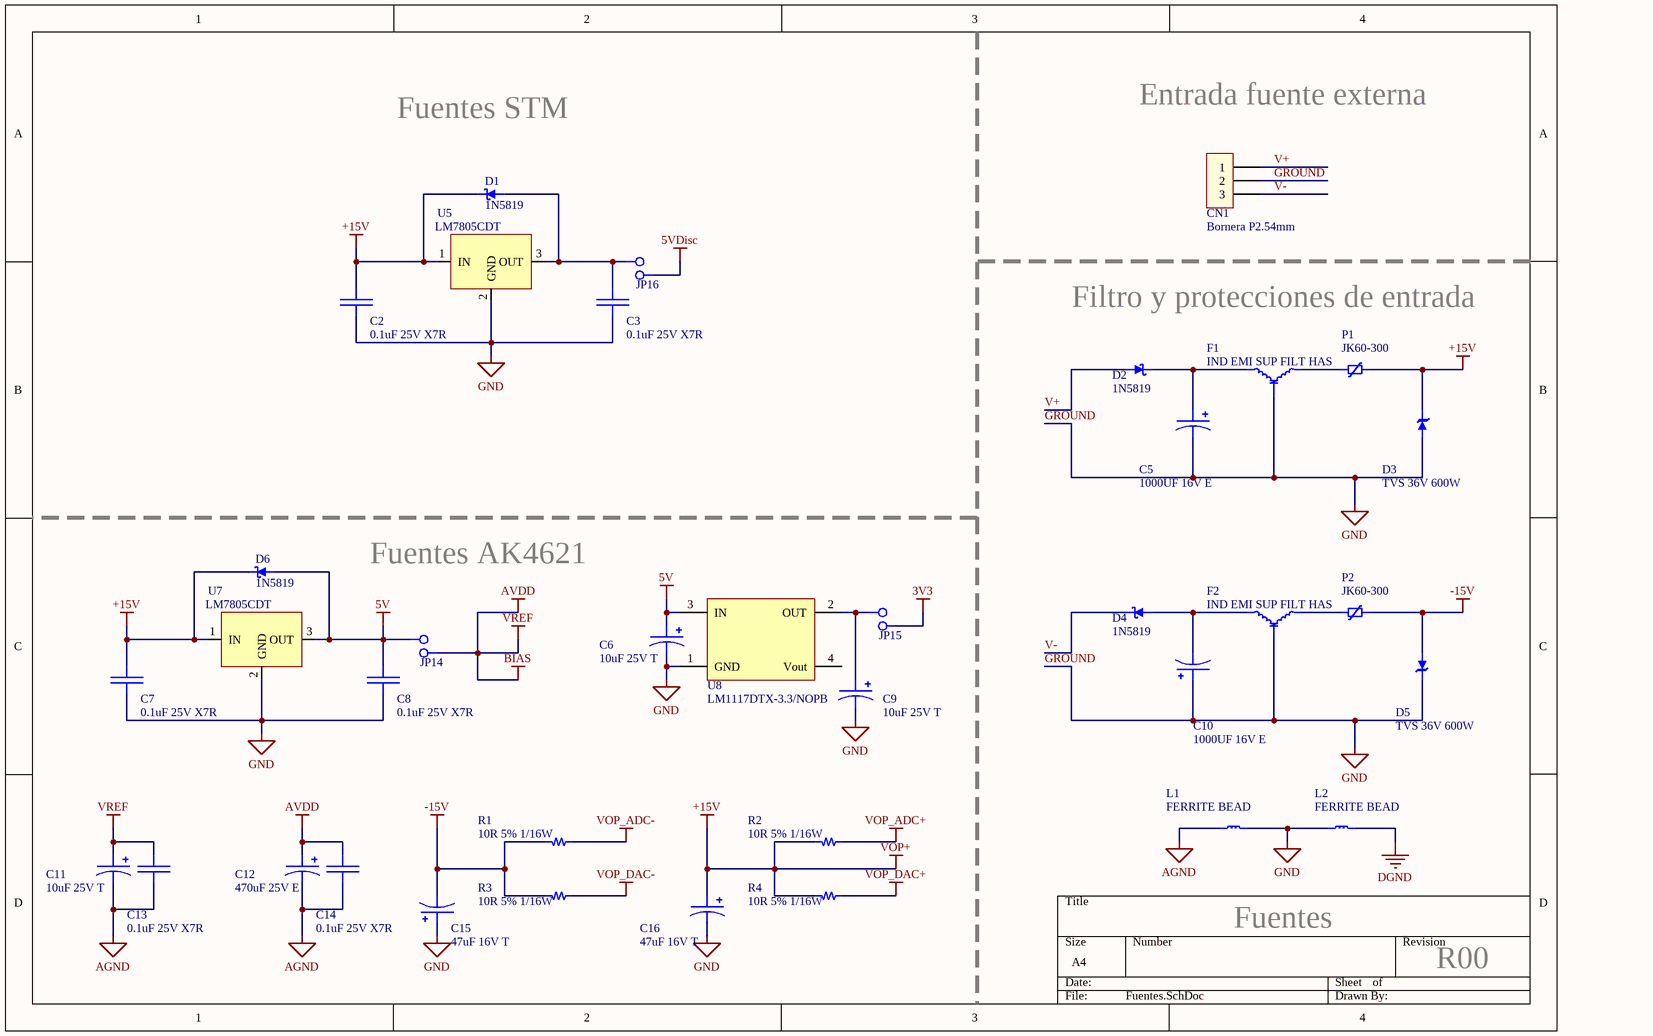
[diagram p8: Fuentes.SchDoc]

### Parts
C2  0.1uF 25V X7R  [C_0805]
C3  0.1uF 25V X7R  [C_0805]
C5  1000UF 16V E  [Capael_10x16 RAD]
C6  10uF 25V T  [TANT]
C7  0.1uF 25V X7R  [C_0805]
C8  0.1uF 25V X7R  [C_0805]
C9  10uF 25V T  [TANT]
C10  1000UF 16V E  [Capael_10x16 RAD]
C11  10uF 25V T  [TANT]
C12  470uF 25V E  [Capael_8x12 RAD]
C13  0.1uF 25V X7R  [C_0805]
C14  0.1uF 25V X7R  [C_0805]
C15  47uF 16V T  [TANT]
C16  47uF 16V T  [TANT]
CN1  Bornera P2.54mm  [Conn_3_1]
D1  1N5819  [59-04]
D2  1N5819  [59-04]
D3  TVS 36V 600W  [59-04]
D4  1N5819  [59-04]
D5  TVS 36V 600W  [59-04]
D6  1N5819  [59-04]
F1  IND EMI SUP FILT HAS  [EMIFIL_DSS6_S]
F2  IND EMI SUP FILT HAS  [EMIFIL_DSS6_S]
JP14  Jumper 2x1  [Conn_2_1]  (value not drawn)
JP15  Jumper 2x1  [Conn_2_1]  (value not drawn)
JP16  Jumper 2x1  [Conn_2_1]  (value not drawn)
L1  FERRITE BEAD  [EC22/KC204]
L2  FERRITE BEAD  [EC22/KC204]
P1  JK60-300  [JK60-300]
P2  JK60-300  [JK60-300]
R1  10R 5% 1/16W  [R_0805]
R2  10R 5% 1/16W  [R_0805]
R3  10R 5% 1/16W  [R_0805]
R4  10R 5% 1/16W  [R_0805]
U5  LM7805CDT  [TO-220-3]
U7  LM7805CDT  [TO-220-3]
U8  LM1117DTX-3.3/NOPB  [DPAK]

### Nets
3V3: JP15.2
5V: C6.1 C8.1 D6.1(|) JP14.1 U7.3(OUT) U8.3(IN)
5VDisc: JP16.2
+15V: C2.1 C7.1 C16.1 D1.2 D3.2 D6.2 P1.2 R2.2 R4.2 U5.1(IN) U7.1(IN)  [also labelled VOP+]
-15V: C15.2 D5.1(|) P2.2 R1.2 R3.2
AGND: C11.2 C12.2 C13.2 C14.2 L1.1
AVDD: C11.1 C12.1 C13.1 C14.1 JP14.2  [also labelled BIAS, VREF]
DGND: L2.2
GROUND: C2.2 C3.2 C5.2 C6.2 C7.2 C8.2 C9.2 C10.1 C15.1 C16.2 CN1.2 D3.1(|) D5.2 F1.2 F2.2 L1.2 L2.1 U5.2(GND) U7.2(GND) U8.1(GND)  [also labelled GND]
VOP_ADC+: R2.1
VOP_ADC-: R1.1
VOP_DAC+: R4.1
VOP_DAC-: R3.1
V+: CN1.1 D2.1(|)
V-: CN1.3 D4.2
NetC3_1: C3.1 D1.1(|) JP16.1 U5.3(OUT)
NetC5_1: C5.1 D2.2 F1.1
NetC9_1: C9.1 JP15.1 U8.2(OUT)
NetC10_2: C10.2 D4.1(|) F2.1
NetF1_3: F1.3 P1.1
NetF2_3: F2.3 P2.1

Not connected (* = marked no-connect by the designer): U8 4(Vout)

### Notes on the sheet
- Entrada fuente externa
- Fuentes STM
- Filtro y protecciones de entrada
- Fuentes AK4621
- Fuentes
- R00

### Library data of the parts
C2 C3 C7 C8 C13 C14 = Capacitor: as C20 on sheet INL
C5 C10 = CapaPol: Capacitor polarizado; Cod. Proveedor: CA3609183; Proveedor: Elemon; Encapsulado: TH-10x16
C6 C9 C11 C12 C15 C16 = CapaPol: Capacitor polarizado; Encapsulado: TH; Cod. Proveedor: -; Proveedor: -
CN1 = Conn_3_1: Conector de 3 pines en hilera
D1 D2 D4 D6 = Schottky: Diodo Schottky; Encapsulado: TH; Cod. Proveedor: -; Proveedor: -
D3 D5 = TVS: Diodo TVS; Cod. Proveedor: DI120SMDDIK36AT3G; Proveedor: Elemon; Encapsulado: SMB
F1 = EMI_3T: Filtro EMI 3 terminales; Cod. Proveedor: FI151VINBOB600; Proveedor: Elemon; Encapsulado: DSS6_S; Otro del mismo proveedor: FI1521500
F2 = EMI_3T: Filtro EMI 3 terminales; Cod. Proveedor: FI151VINBOB600; Proveedor: Elemon; Encapsulado: DSS6_S
L1 L2 = Inductor: Encapsulado: TH; Cod. Proveedor: -; Proveedor: -
P1 P2 = Poly: Cod. Proveedor: TE2627680; Proveedor: Elemon; Encapsulado: TH
R1-R4 = Resistor: Resistencia; Cod. Proveedor: RS3866060; Encapsulado: 0603; Proveedor: Elemon
U5 U7 = LM7805: Regulador lineal 5V; Cod. Proveedor: CI2707459; Proveedor: Elemon; Encapsulado: TO-220-3
U8 = LM1117: Regulador Switching; Cod. Proveedor: CI2707214D; Proveedor: Elemon; Encapsulado: DPAK

## Sheet GainCHL.SchDoc
size A4
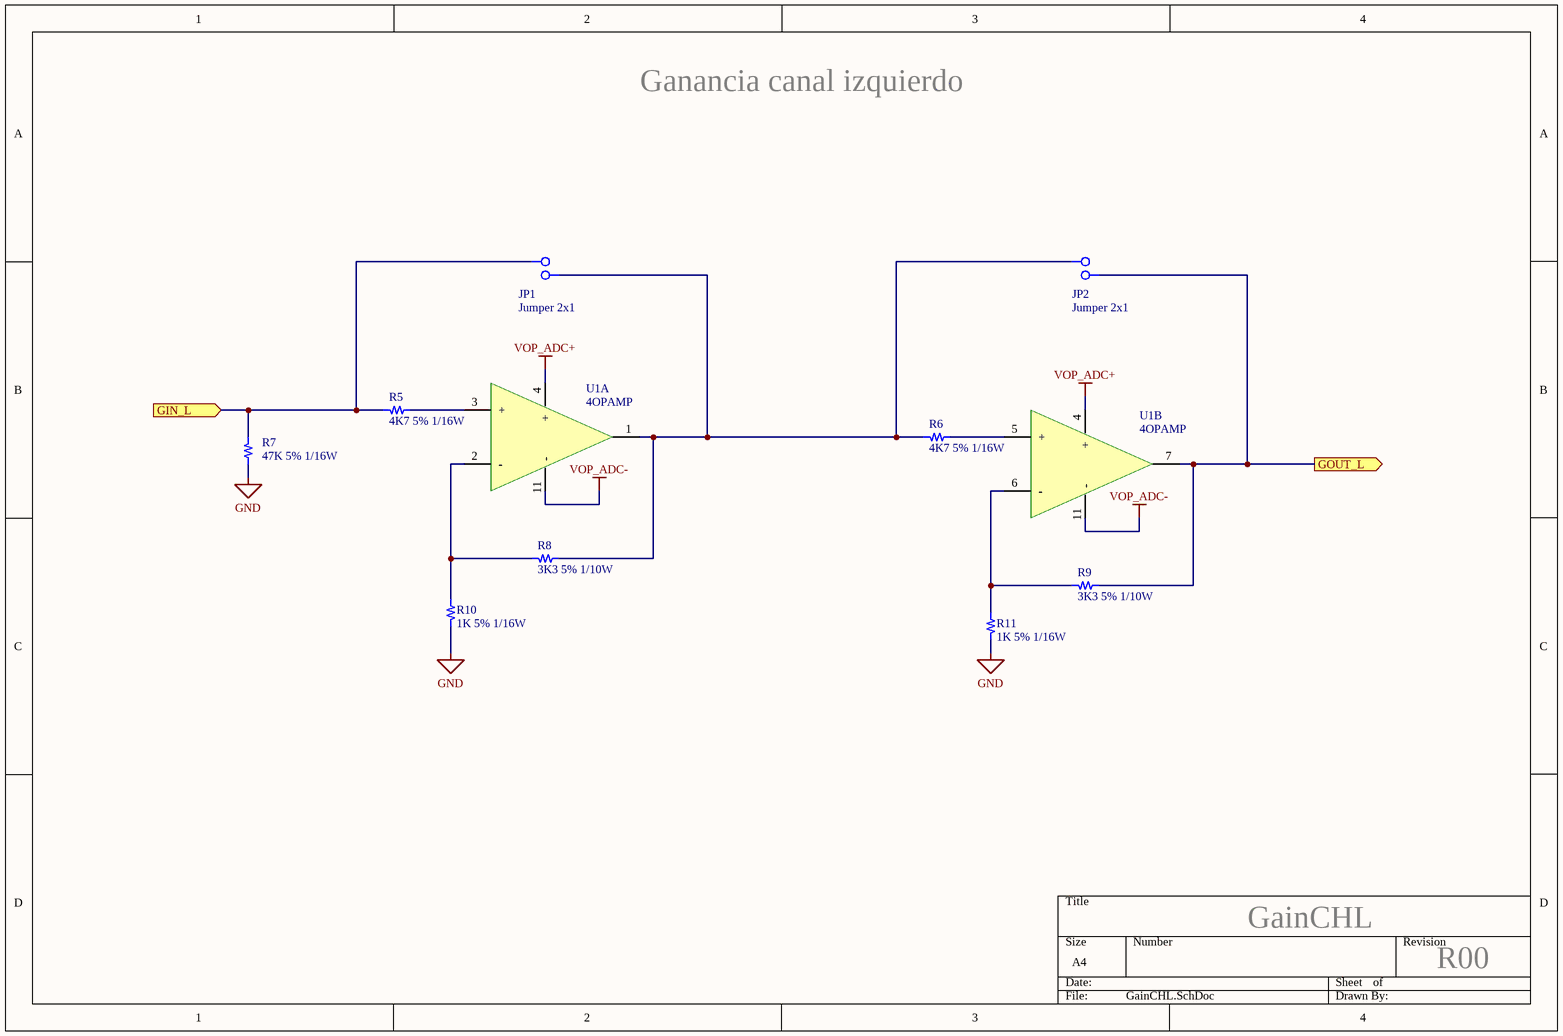
[diagram p9: GainCHL.SchDoc]

### Parts
JP1  Jumper 2x1  [Conn_2_1]
JP2  Jumper 2x1  [Conn_2_1]
R5  4K7 5% 1/16W  [R_0805]
R6  4K7 5% 1/16W  [R_0805]
R7  47K 5% 1/16W  [R_0805]
R8  3K3 5% 1/10W  [R_0805]
R9  3K3 5% 1/10W  [R_0805]
R10  1K 5% 1/16W  [R_0805]
R11  1K 5% 1/16W  [R_0805]
U1  4OPAMP  [SOIC14]  (parts A,B of 4)

### Ports
GIN_L (in), GOUT_L (out)

### Nets
GND: R7.1 R10.2 R11.2  [project net GROUND]
VOP_ADC+: U1.4(+)
VOP_ADC-: U1.11(-)
NetC25_2: JP2.2 R9.1 U1.7(OUT) ; port GOUT_L
NetCN2_2: JP1.1 R5.2 R7.2 ; port GIN_L
NetJP1_2: JP1.2 JP2.1 R6.2 R8.1 U1.1(OUT)
NetR5_1: R5.1 U1.3(+)
NetR6_1: R6.1 U1.5(+)
NetR8_2: R8.2 R10.1 U1.2(-)
NetR9_2: R9.2 R11.1 U1.6(-)

### Notes on the sheet
- Ganancia canal izquierdo
- GainCHL
- R00

### Library data of the parts
JP1 JP2 = Jumper 2x1: Cod. Proveedor: CO4921360; Proveedor: Elemon
R5 = Resistor: Resistencia; Encapsulado: 0805; Proveedor: Elemon; Cod. Proveedor: RS3896225
R6 = Resistor: as R21 on sheet INL
R7 = Resistor: Resistencia; Encapsulado: 0805; Cod. Proveedor: -; Proveedor: -
R8 R9 = Resistor: Resistencia; Cod. Proveedor: RS3896215; Encapsulado: 0805; Proveedor: Elemon
R10 R11 = Resistor: Resistencia; Cod. Proveedor: RS3866185; Encapsulado: 0603; Proveedor: Elemon
U1 = 4OPAMP: Integrado con 4 operacionales; Cod. Proveedor: -; Proveedor: -; Encapsulado: SOIC14

## Sheet GainCHR.SchDoc
size A4
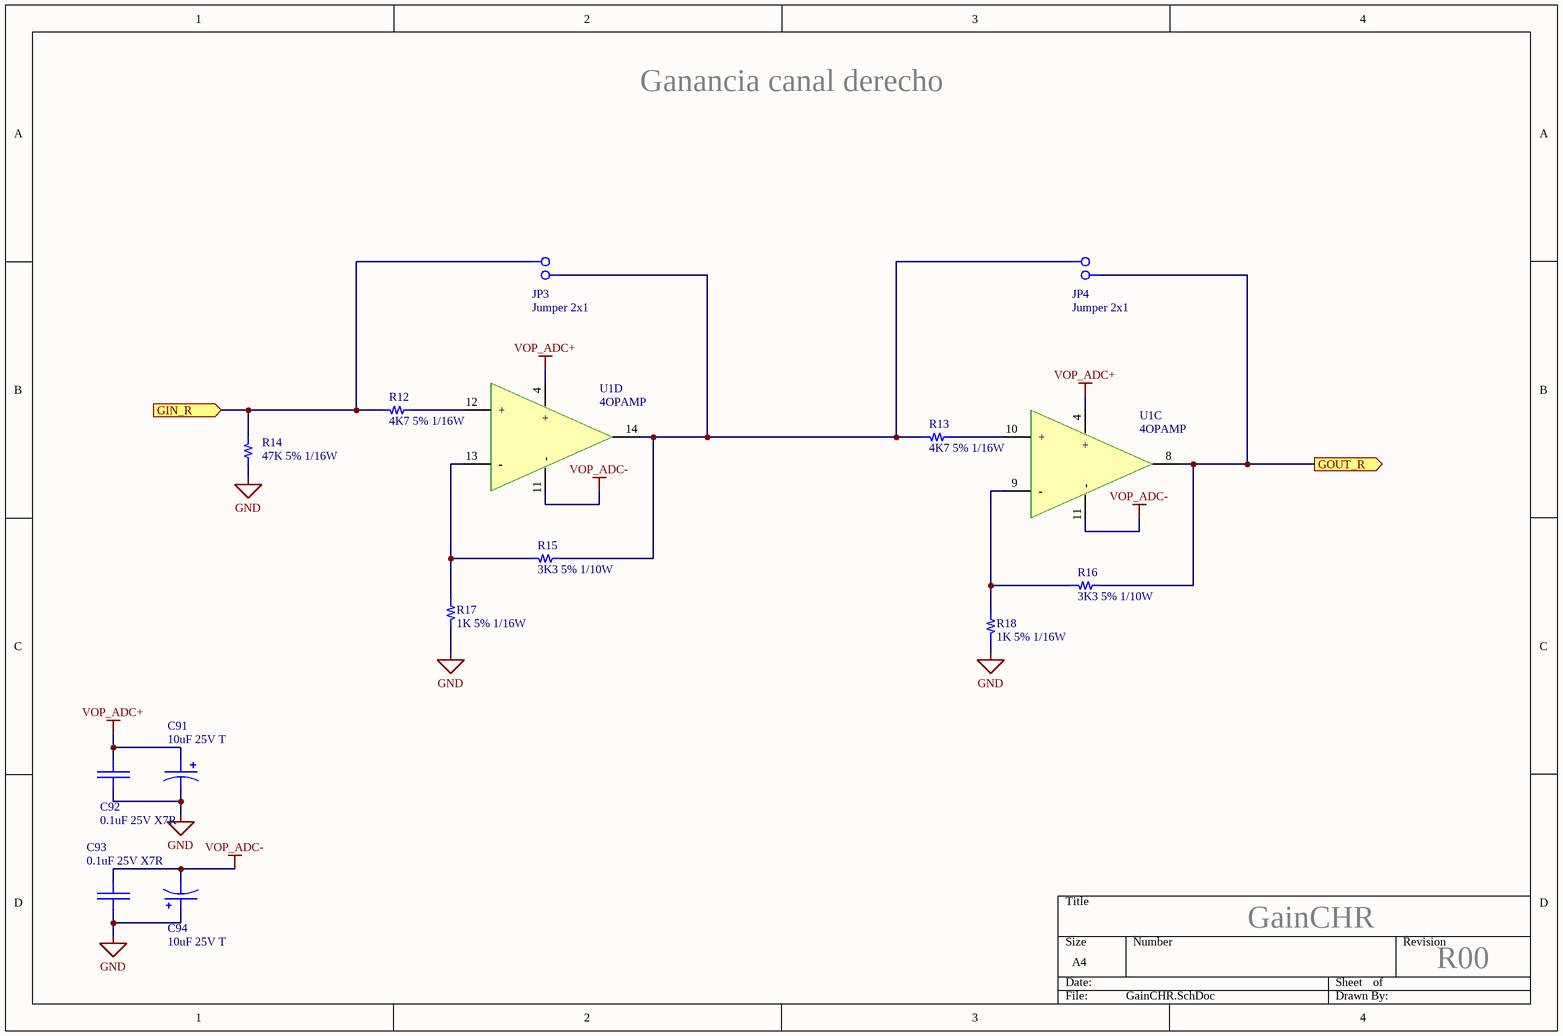
[diagram p10: GainCHR.SchDoc]

### Parts
C91  10uF 25V T  [TANT]
C92  0.1uF 25V X7R  [C_0805]
C93  0.1uF 25V X7R  [C_0805]
C94  10uF 25V T  [TANT]
JP3  Jumper 2x1  [Conn_2_1]
JP4  Jumper 2x1  [Conn_2_1]
R12  4K7 5% 1/16W  [R_0805]
R13  4K7 5% 1/16W  [R_0805]
R14  47K 5% 1/16W  [R_0805]
R15  3K3 5% 1/10W  [R_0805]
R16  3K3 5% 1/10W  [R_0805]
R17  1K 5% 1/16W  [R_0805]
R18  1K 5% 1/16W  [R_0805]
U1  4OPAMP  [SOIC14]  (parts C,D of 4)

### Ports
GIN_R (in), GOUT_R (out)

### Nets
GND: C91.2 C92.2 C93.2 C94.1 R14.1 R17.2 R18.2  [project net GROUND]
VOP_ADC+: C91.1 C92.1 U1.4(+)
VOP_ADC-: C93.1 C94.2 U1.11(-)
NetC36_2: JP4.2 R16.1 U1.8(OUT) ; port GOUT_R
NetCN3_2: JP3.1 R12.2 R14.2 ; port GIN_R
NetJP3_2: JP3.2 JP4.1 R13.2 R15.1 U1.14(OUT)
NetR12_1: R12.1 U1.12(+)
NetR13_1: R13.1 U1.10(+)
NetR15_2: R15.2 R17.1 U1.13(-)
NetR16_2: R16.2 R18.1 U1.9(-)

### Notes on the sheet
- Ganancia canal derecho
- GainCHR
- R00

### Library data of the parts
C91 C94 = CapaPol: Capacitor polarizado; Encapsulado: TH; Cod. Proveedor: -; Proveedor: -
C92 C93 = Capacitor: as C20 on sheet INL
JP3 JP4 = Jumper 2x1: as JP1 on sheet GainCHL
R12 = Resistor: as R5 on sheet GainCHL
R13 = Resistor: as R21 on sheet INL
R14 = Resistor: Resistencia; Encapsulado: 0805; Cod. Proveedor: -; Proveedor: -
R15 R16 = Resistor: as R8 on sheet GainCHL
R17 R18 = Resistor: as R10 on sheet GainCHL
U1 = 4OPAMP: Integrado con 4 operacionales; Cod. Proveedor: -; Proveedor: -; Encapsulado: SOIC14

## Nets that join several sheets
3V3: STM_AK (5 pins), Fuentes (JP15.2)
5VDisc: STM_AK (U10.P2.3 U10.P2.4), Fuentes (JP16.2)
AGND: STM_AK (C89.2 C90.2 U9.7 U9.26), Fuentes (5 pins)
AVDD: INL (R30.2), INR (R44.2), STM_AK (U9.6 U9.8), Fuentes (5 pins)
DGND: STM_AK (15 pins), Fuentes (L2.2)
GROUND: INL (10 pins), INR (10 pins), STM_AK (C87.2 C88.2), OUTL (20 pins), OUTR (20 pins), Input (CN2.1 CN2.3 CN3.1 CN3.3), Output (P3.2 P4.2), Fuentes (20 pins), GainCHL (R7.1 R10.2 R11.2), GainCHR (7 pins)
VOP_ADC+: INL (C19.1 C20.1 U3.4), INR (C30.1 C31.1 U2.4), Fuentes (R2.1), GainCHL (U1.4), GainCHR (C91.1 C92.1 U1.4)
VOP_ADC-: INL (C21.1 C23.2 U3.11), INR (C32.1 C34.2 U2.11), Fuentes (R1.1), GainCHL (U1.11), GainCHR (C93.1 C94.2 U1.11)
VOP_DAC+: OUTL (C52.1 C54.1 U4.4), OUTR (C76.1 C78.1 U11.4), Fuentes (R4.1)
VOP_DAC-: OUTL (C56.1 C61.2 U4.11), OUTR (C80.1 C85.2 U11.11), Fuentes (R3.1)
AINL_N: INL (JP9.1), STM_AK (U9.5)
AINL_P: INL (JP8.2), STM_AK (U9.4)
AINR_N: INR (JP7.1), STM_AK (U9.3)
AINR_P: INR (JP6.2), STM_AK (U9.2)
NetC25_2: INL (C25.2 R22.2), GainCHL (JP2.2 R9.1 U1.7)
NetC36_2: INR (C36.2 R36.2), GainCHR (JP4.2 R16.1 U1.8)
NetCN2_2: Input (CN2.2), GainCHL (JP1.1 R5.2 R7.2)
NetCN3_2: Input (CN3.2), GainCHR (JP3.1 R12.2 R14.2)
NetJP10_1: STM_AK (U9.27), OUTL (JP10.1)
NetJP11_1: STM_AK (U9.28), OUTL (JP11.1)
NetJP12_1: STM_AK (U9.29), OUTR (JP12.1)
NetJP13_1: STM_AK (U9.30), OUTR (JP13.1)
NetP3_1: OUTL (R56.2), Output (P3.1)
NetP4_1: OUTR (R73.2), Output (P4.1)